# EAGLE schematic YMH01x (EAGLE 9.3.0)

## Sheet 1 of 2
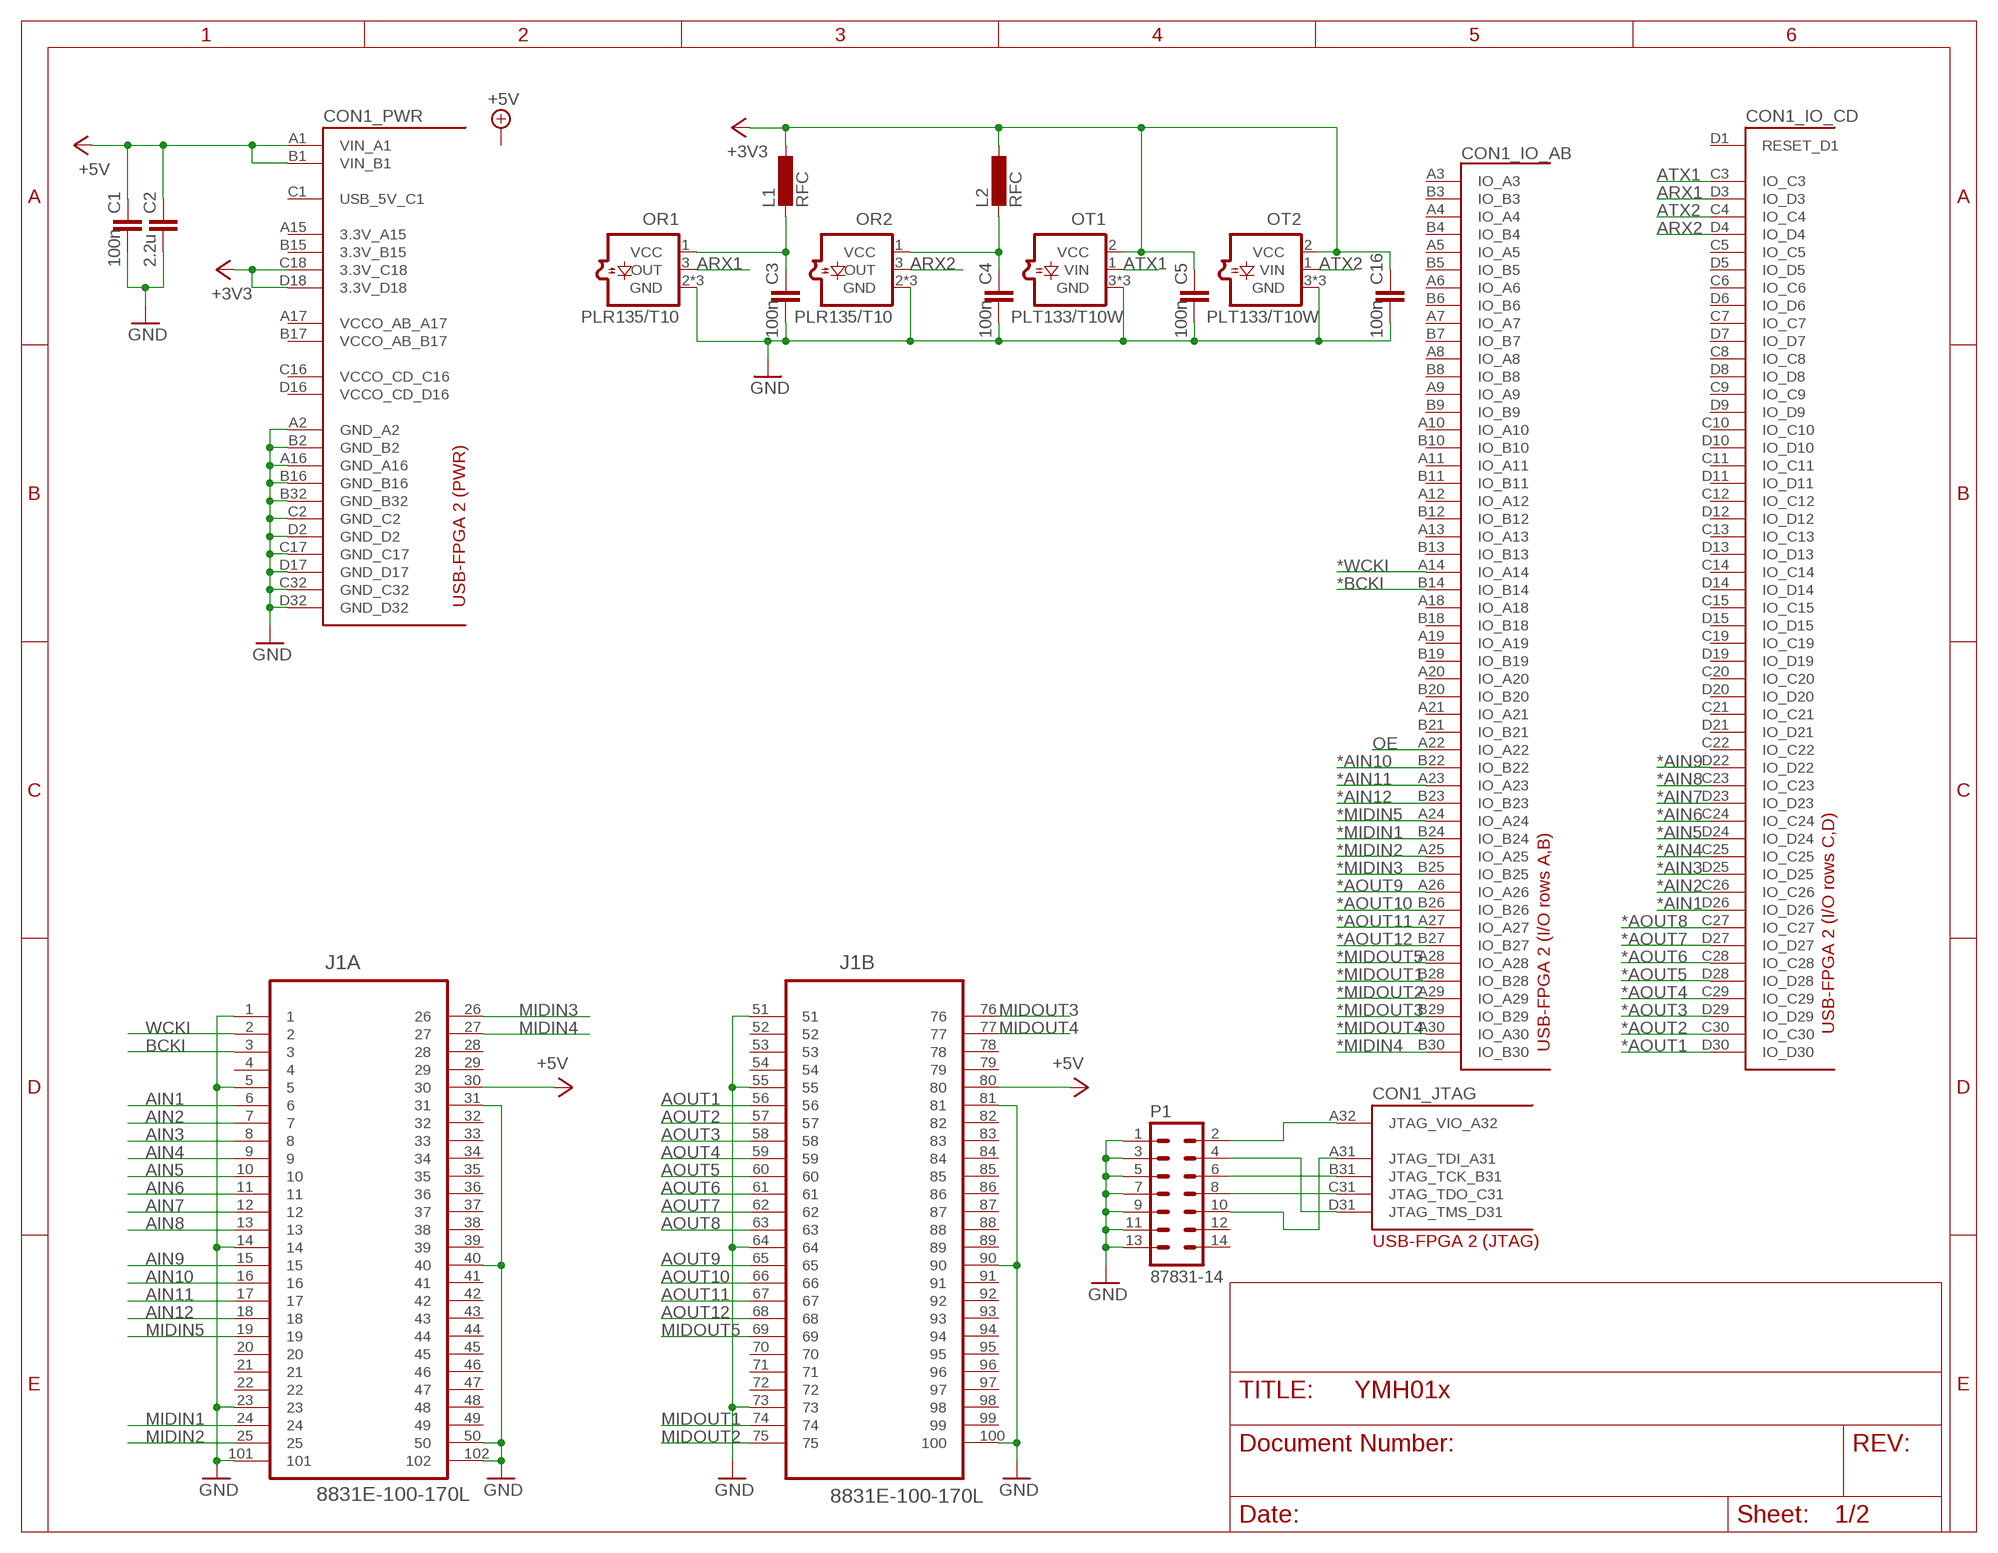
[diagram p0: schematic, sheet 1]

### Parts
C1  100n  C-EUC0603  [C0603]
C2  2.2u  C-EUC0603  [C0603]
C3  100n  C-EUC0603  [C0603]
C4  100n  C-EUC0603  [C0603]
C5  100n  C-EUC0603  [C0603]
C16  100n  C-EUC0603  [C0603]
CON1  USB-FPGA-2THT  [USB-FPGA-2-THT]
J1  8831E-100-170L  [KEL_8831E-100-170L]
L1  RFC  L-EUL2012C  [L2012C]
L2  RFC  L-EUL2012C  [L2012C]
OR1  PLR135/T10  [PLR135/T10]
OR2  PLR135/T10  [PLR135/T10]
OT1  PLT133/T10W  [PLT133/T10]
OT2  PLT133/T10W  [PLT133/T10]
P1  87831-14  [87831-14]

### Nets
*AIN1: CON1.D26(_IO_CD:IO_D26) ; also sheet 2
*AIN2: CON1.C26(_IO_CD:IO_C26) ; also sheet 2
*AIN3: CON1.D25(_IO_CD:IO_D25) ; also sheet 2
*AIN4: CON1.C25(_IO_CD:IO_C25) ; also sheet 2
*AIN5: CON1.D24(_IO_CD:IO_D24) ; also sheet 2
*AIN6: CON1.C24(_IO_CD:IO_C24) ; also sheet 2
*AIN7: CON1.D23(_IO_CD:IO_D23) ; also sheet 2
*AIN8: CON1.C23(_IO_CD:IO_C23) ; also sheet 2
*AIN9: CON1.D22(_IO_CD:IO_D22) ; also sheet 2
*AIN10: CON1.B22(_IO_AB:IO_B22) ; also sheet 2
*AIN11: CON1.A23(_IO_AB:IO_A23) ; also sheet 2
*AIN12: CON1.B23(_IO_AB:IO_B23) ; also sheet 2
*AOUT1: CON1.D30(_IO_CD:IO_D30) ; also sheet 2
*AOUT2: CON1.C30(_IO_CD:IO_C30) ; also sheet 2
*AOUT3: CON1.D29(_IO_CD:IO_D29) ; also sheet 2
*AOUT4: CON1.C29(_IO_CD:IO_C29) ; also sheet 2
*AOUT5: CON1.D28(_IO_CD:IO_D28) ; also sheet 2
*AOUT6: CON1.C28(_IO_CD:IO_C28) ; also sheet 2
*AOUT7: CON1.D27(_IO_CD:IO_D27) ; also sheet 2
*AOUT8: CON1.C27(_IO_CD:IO_C27) ; also sheet 2
*AOUT9: CON1.A26(_IO_AB:IO_A26) ; also sheet 2
*AOUT10: CON1.B26(_IO_AB:IO_B26) ; also sheet 2
*AOUT11: CON1.A27(_IO_AB:IO_A27) ; also sheet 2
*AOUT12: CON1.B27(_IO_AB:IO_B27) ; also sheet 2
*BCKI: CON1.B14(_IO_AB:IO_B14) ; also sheet 2
*MIDIN1: CON1.B24(_IO_AB:IO_B24) ; also sheet 2
*MIDIN2: CON1.A25(_IO_AB:IO_A25) ; also sheet 2
*MIDIN3: CON1.B25(_IO_AB:IO_B25) ; also sheet 2
*MIDIN4: CON1.B30(_IO_AB:IO_B30) ; also sheet 2
*MIDIN5: CON1.A24(_IO_AB:IO_A24) ; also sheet 2
*MIDOUT1: CON1.B28(_IO_AB:IO_B28) ; also sheet 2
*MIDOUT2: CON1.A29(_IO_AB:IO_A29) ; also sheet 2
*MIDOUT3: CON1.B29(_IO_AB:IO_B29) ; also sheet 2
*MIDOUT4: CON1.A30(_IO_AB:IO_A30) ; also sheet 2
*MIDOUT5: CON1.A28(_IO_AB:IO_A28) ; also sheet 2
*WCKI: CON1.A14(_IO_AB:IO_A14) ; also sheet 2
+3V3: C5.1 C16.1 CON1.C18(_PWR:3.3V_C18) CON1.D18(_PWR:3.3V_D18) L1.1 L2.1 OT1.2(VCC) OT2.2(VCC) ; also sheet 2
+5V: C1.1 C2.1 CON1.A1(_PWR:VIN_A1) CON1.B1(_PWR:VIN_B1) J1.30 J1.80 ; also sheet 2
AIN1: J1.6 ; also sheet 2
AIN2: J1.7 ; also sheet 2
AIN3: J1.8 ; also sheet 2
AIN4: J1.9 ; also sheet 2
AIN5: J1.10 ; also sheet 2
AIN6: J1.11 ; also sheet 2
AIN7: J1.12 ; also sheet 2
AIN8: J1.13 ; also sheet 2
AIN9: J1.15 ; also sheet 2
AIN10: J1.16 ; also sheet 2
AIN11: J1.17 ; also sheet 2
AIN12: J1.18 ; also sheet 2
AOUT1: J1.56 ; also sheet 2
AOUT2: J1.57 ; also sheet 2
AOUT3: J1.58 ; also sheet 2
AOUT4: J1.59 ; also sheet 2
AOUT5: J1.60 ; also sheet 2
AOUT6: J1.61 ; also sheet 2
AOUT7: J1.62 ; also sheet 2
AOUT8: J1.63 ; also sheet 2
AOUT9: J1.65 ; also sheet 2
AOUT10: J1.66 ; also sheet 2
AOUT11: J1.67 ; also sheet 2
AOUT12: J1.68 ; also sheet 2
ARX1: CON1.D3(_IO_CD:IO_D3) OR1.3(OUT)
ARX2: CON1.D4(_IO_CD:IO_D4) OR2.3(OUT)
ATX1: CON1.C3(_IO_CD:IO_C3) OT1.1(VIN)
ATX2: CON1.C4(_IO_CD:IO_C4) OT2.1(VIN)
BCKI: J1.3 ; also sheet 2
GND: C1.2 C2.2 C3.2 C4.2 C5.2 C16.2 CON1.A2(_PWR:GND_A2) CON1.A16(_PWR:GND_A16) CON1.B2(_PWR:GND_B2) CON1.B16(_PWR:GND_B16) CON1.B32(_PWR:GND_B32) CON1.C2(_PWR:GND_C2) CON1.C17(_PWR:GND_C17) CON1.C32(_PWR:GND_C32) CON1.D2(_PWR:GND_D2) CON1.D17(_PWR:GND_D17) CON1.D32(_PWR:GND_D32) J1.1 J1.5 J1.14 J1.23 J1.31 J1.40 J1.50 J1.51 J1.55 J1.64 J1.73 J1.81 J1.90 J1.100 J1.101 J1.102 OR1.2(GND) OR1.NC1(GND) OR1.NC2(GND) OR2.2(GND) OR2.NC1(GND) OR2.NC2(GND) OT1.3(GND) OT1.NC1(GND) OT1.NC2(GND) OT2.3(GND) OT2.NC1(GND) OT2.NC2(GND) P1.1 P1.3 P1.5 P1.7 P1.9 P1.11 P1.13 ; also sheet 2
MIDIN1: J1.24 ; also sheet 2
MIDIN2: J1.25 ; also sheet 2
MIDIN3: J1.26 ; also sheet 2
MIDIN4: J1.27 ; also sheet 2
MIDIN5: J1.19 ; also sheet 2
MIDOUT1: J1.74 ; also sheet 2
MIDOUT2: J1.75 ; also sheet 2
MIDOUT3: J1.76 ; also sheet 2
MIDOUT4: J1.77 ; also sheet 2
MIDOUT5: J1.69 ; also sheet 2
N$1: CON1.A32(_JTAG:JTAG_VIO_A32) P1.2
N$2: CON1.D31(_JTAG:JTAG_TMS_D31) P1.4
N$3: CON1.B31(_JTAG:JTAG_TCK_B31) P1.6
N$4: CON1.C31(_JTAG:JTAG_TDO_C31) P1.8
N$5: CON1.A31(_JTAG:JTAG_TDI_A31) P1.10
N$7: C3.1 L1.2 OR1.1(VCC)
N$8: C4.1 L2.2 OR2.1(VCC)
OE: CON1.A22(_IO_AB:IO_A22) ; also sheet 2
WCKI: J1.2 ; also sheet 2
Unconnected: CON1.A3(_IO_AB:IO_A3) CON1.A4(_IO_AB:IO_A4) CON1.A5(_IO_AB:IO_A5) CON1.A6(_IO_AB:IO_A6) CON1.A7(_IO_AB:IO_A7) CON1.A8(_IO_AB:IO_A8) CON1.A9(_IO_AB:IO_A9) CON1.A10(_IO_AB:IO_A10) CON1.A11(_IO_AB:IO_A11) CON1.A12(_IO_AB:IO_A12) CON1.A13(_IO_AB:IO_A13) CON1.A15(_PWR:3.3V_A15) CON1.A17(_PWR:VCCO_AB_A17) CON1.A18(_IO_AB:IO_A18) CON1.A19(_IO_AB:IO_A19) CON1.A20(_IO_AB:IO_A20) CON1.A21(_IO_AB:IO_A21) CON1.B3(_IO_AB:IO_B3) CON1.B4(_IO_AB:IO_B4) CON1.B5(_IO_AB:IO_B5) CON1.B6(_IO_AB:IO_B6) CON1.B7(_IO_AB:IO_B7) CON1.B8(_IO_AB:IO_B8) CON1.B9(_IO_AB:IO_B9) CON1.B10(_IO_AB:IO_B10) CON1.B11(_IO_AB:IO_B11) CON1.B12(_IO_AB:IO_B12) CON1.B13(_IO_AB:IO_B13) CON1.B15(_PWR:3.3V_B15) CON1.B17(_PWR:VCCO_AB_B17) CON1.B18(_IO_AB:IO_B18) CON1.B19(_IO_AB:IO_B19) CON1.B20(_IO_AB:IO_B20) CON1.B21(_IO_AB:IO_B21) CON1.C1(_PWR:USB_5V_C1) CON1.C5(_IO_CD:IO_C5) CON1.C6(_IO_CD:IO_C6) CON1.C7(_IO_CD:IO_C7) CON1.C8(_IO_CD:IO_C8) CON1.C9(_IO_CD:IO_C9) CON1.C10(_IO_CD:IO_C10) CON1.C11(_IO_CD:IO_C11) CON1.C12(_IO_CD:IO_C12) CON1.C13(_IO_CD:IO_C13) CON1.C14(_IO_CD:IO_C14) CON1.C15(_IO_CD:IO_C15) CON1.C16(_PWR:VCCO_CD_C16) CON1.C19(_IO_CD:IO_C19) CON1.C20(_IO_CD:IO_C20) CON1.C21(_IO_CD:IO_C21) CON1.C22(_IO_CD:IO_C22) CON1.D1(_IO_CD:RESET_D1) CON1.D5(_IO_CD:IO_D5) CON1.D6(_IO_CD:IO_D6) CON1.D7(_IO_CD:IO_D7) CON1.D8(_IO_CD:IO_D8) CON1.D9(_IO_CD:IO_D9) CON1.D10(_IO_CD:IO_D10) CON1.D11(_IO_CD:IO_D11) CON1.D12(_IO_CD:IO_D12) CON1.D13(_IO_CD:IO_D13) CON1.D14(_IO_CD:IO_D14) CON1.D15(_IO_CD:IO_D15) CON1.D16(_PWR:VCCO_CD_D16) CON1.D19(_IO_CD:IO_D19) CON1.D20(_IO_CD:IO_D20) CON1.D21(_IO_CD:IO_D21) J1.4 J1.20 J1.21 J1.22 J1.28 J1.29 J1.32 J1.33 J1.34 J1.35 J1.36 J1.37 J1.38 J1.39 J1.41 J1.42 J1.43 J1.44 J1.45 J1.46 J1.47 J1.48 J1.49 J1.52 J1.53 J1.54 J1.70 J1.71 J1.72 J1.78 J1.79 J1.82 J1.83 J1.84 J1.85 J1.86 J1.87 J1.88 J1.89 J1.91 J1.92 J1.93 J1.94 J1.95 J1.96 J1.97 J1.98 J1.99 P1.12 P1.14

## Sheet 2 of 2
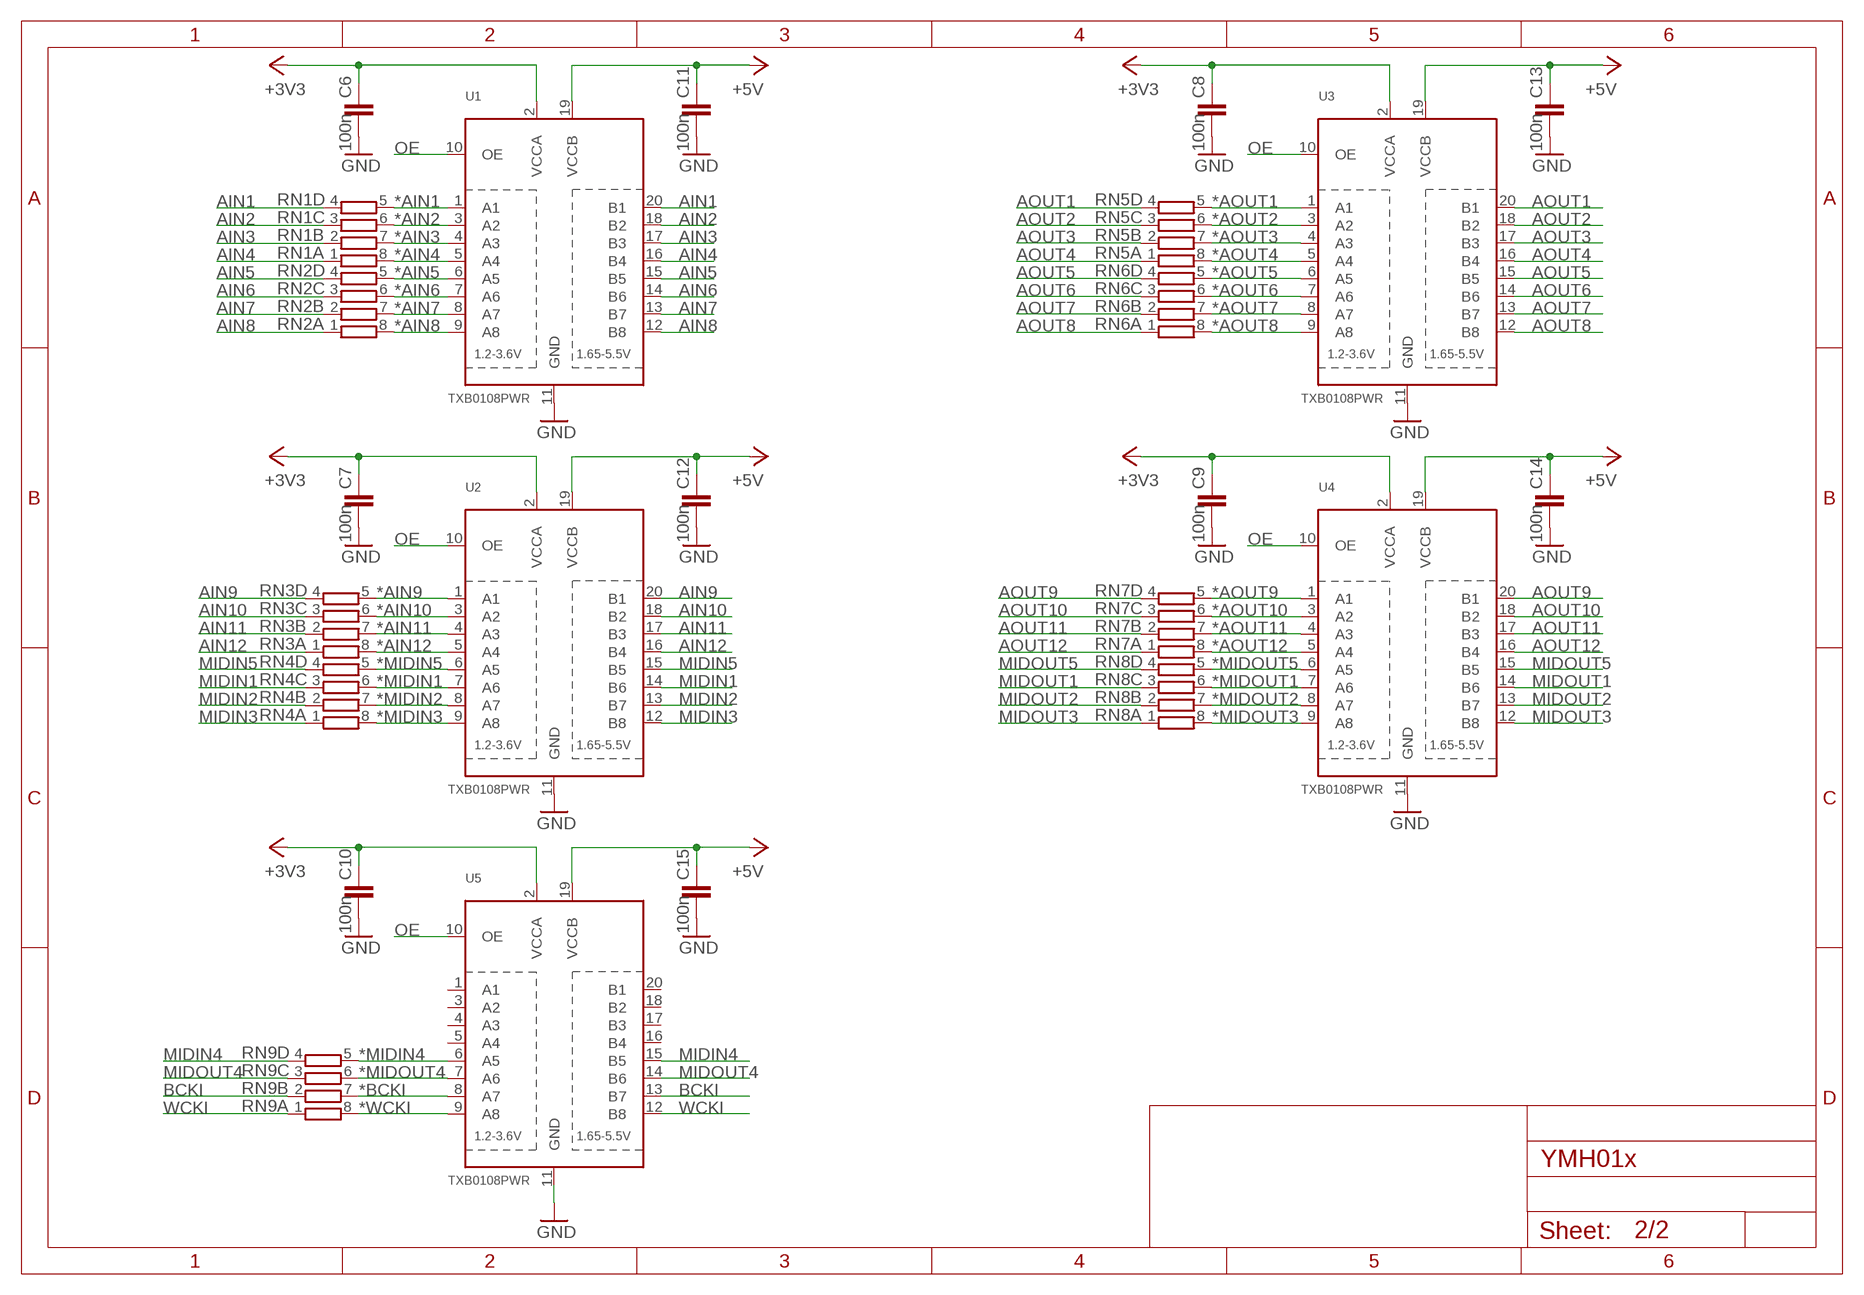
[diagram p1: schematic, sheet 2]

### Parts
C6  100n  C-EUC0603  [C0603]
C7  100n  C-EUC0603  [C0603]
C8  100n  C-EUC0603  [C0603]
C9  100n  C-EUC0603  [C0603]
C10  100n  C-EUC0603  [C0603]
C11  100n  C-EUC0603  [C0603]
C12  100n  C-EUC0603  [C0603]
C13  100n  C-EUC0603  [C0603]
C14  100n  C-EUC0603  [C0603]
C15  100n  C-EUC0603  [C0603]
RN1  4R-N0603-ARC  [0603-ARC]
RN2  4R-N0603-ARC  [0603-ARC]
RN3  4R-N0603-ARC  [0603-ARC]
RN4  4R-N0603-ARC  [0603-ARC]
RN5  4R-N0603-ARC  [0603-ARC]
RN6  4R-N0603-ARC  [0603-ARC]
RN7  4R-N0603-ARC  [0603-ARC]
RN8  4R-N0603-ARC  [0603-ARC]
RN9  4R-N0603-ARC  [0603-ARC]
U1  TXB0108PWR  [TSSOP20]
U2  TXB0108PWR  [TSSOP20]
U3  TXB0108PWR  [TSSOP20]
U4  TXB0108PWR  [TSSOP20]
U5  TXB0108PWR  [TSSOP20]

### Nets
*AIN1: RN1.5 U1.1(A1) ; also sheet 1
*AIN2: RN1.6 U1.3(A2) ; also sheet 1
*AIN3: RN1.7 U1.4(A3) ; also sheet 1
*AIN4: RN1.8 U1.5(A4) ; also sheet 1
*AIN5: RN2.5 U1.6(A5) ; also sheet 1
*AIN6: RN2.6 U1.7(A6) ; also sheet 1
*AIN7: RN2.7 U1.8(A7) ; also sheet 1
*AIN8: RN2.8 U1.9(A8) ; also sheet 1
*AIN9: RN3.5 U2.1(A1) ; also sheet 1
*AIN10: RN3.6 U2.3(A2) ; also sheet 1
*AIN11: RN3.7 U2.4(A3) ; also sheet 1
*AIN12: RN3.8 U2.5(A4) ; also sheet 1
*AOUT1: RN5.5 U3.1(A1) ; also sheet 1
*AOUT2: RN5.6 U3.3(A2) ; also sheet 1
*AOUT3: RN5.7 U3.4(A3) ; also sheet 1
*AOUT4: RN5.8 U3.5(A4) ; also sheet 1
*AOUT5: RN6.5 U3.6(A5) ; also sheet 1
*AOUT6: RN6.6 U3.7(A6) ; also sheet 1
*AOUT7: RN6.7 U3.8(A7) ; also sheet 1
*AOUT8: RN6.8 U3.9(A8) ; also sheet 1
*AOUT9: RN7.5 U4.1(A1) ; also sheet 1
*AOUT10: RN7.6 U4.3(A2) ; also sheet 1
*AOUT11: RN7.7 U4.4(A3) ; also sheet 1
*AOUT12: RN7.8 U4.5(A4) ; also sheet 1
*BCKI: RN9.7 U5.8(A7) ; also sheet 1
*MIDIN1: RN4.6 U2.7(A6) ; also sheet 1
*MIDIN2: RN4.7 U2.8(A7) ; also sheet 1
*MIDIN3: RN4.8 U2.9(A8) ; also sheet 1
*MIDIN4: RN9.5 U5.6(A5) ; also sheet 1
*MIDIN5: RN4.5 U2.6(A5) ; also sheet 1
*MIDOUT1: RN8.6 U4.7(A6) ; also sheet 1
*MIDOUT2: RN8.7 U4.8(A7) ; also sheet 1
*MIDOUT3: RN8.8 U4.9(A8) ; also sheet 1
*MIDOUT4: RN9.6 U5.7(A6) ; also sheet 1
*MIDOUT5: RN8.5 U4.6(A5) ; also sheet 1
*WCKI: RN9.8 U5.9(A8) ; also sheet 1
+3V3: C6.1 C7.1 C8.1 C9.1 C10.1 U1.2(VCCA) U2.2(VCCA) U3.2(VCCA) U4.2(VCCA) U5.2(VCCA) ; also sheet 1
+5V: C11.1 C12.1 C13.1 C14.1 C15.1 U1.19(VCCB) U2.19(VCCB) U3.19(VCCB) U4.19(VCCB) U5.19(VCCB) ; also sheet 1
AIN1: RN1.4 U1.20(B1) ; also sheet 1
AIN2: RN1.3 U1.18(B2) ; also sheet 1
AIN3: RN1.2 U1.17(B3) ; also sheet 1
AIN4: RN1.1 U1.16(B4) ; also sheet 1
AIN5: RN2.4 U1.15(B5) ; also sheet 1
AIN6: RN2.3 U1.14(B6) ; also sheet 1
AIN7: RN2.2 U1.13(B7) ; also sheet 1
AIN8: RN2.1 U1.12(B8) ; also sheet 1
AIN9: RN3.4 U2.20(B1) ; also sheet 1
AIN10: RN3.3 U2.18(B2) ; also sheet 1
AIN11: RN3.2 U2.17(B3) ; also sheet 1
AIN12: RN3.1 U2.16(B4) ; also sheet 1
AOUT1: RN5.4 U3.20(B1) ; also sheet 1
AOUT2: RN5.3 U3.18(B2) ; also sheet 1
AOUT3: RN5.2 U3.17(B3) ; also sheet 1
AOUT4: RN5.1 U3.16(B4) ; also sheet 1
AOUT5: RN6.4 U3.15(B5) ; also sheet 1
AOUT6: RN6.3 U3.14(B6) ; also sheet 1
AOUT7: RN6.2 U3.13(B7) ; also sheet 1
AOUT8: RN6.1 U3.12(B8) ; also sheet 1
AOUT9: RN7.4 U4.20(B1) ; also sheet 1
AOUT10: RN7.3 U4.18(B2) ; also sheet 1
AOUT11: RN7.2 U4.17(B3) ; also sheet 1
AOUT12: RN7.1 U4.16(B4) ; also sheet 1
BCKI: RN9.2 U5.13(B7) ; also sheet 1
GND: C6.2 C7.2 C8.2 C9.2 C10.2 C11.2 C12.2 C13.2 C14.2 C15.2 U1.11(GND) U2.11(GND) U3.11(GND) U4.11(GND) U5.11(GND) ; also sheet 1
MIDIN1: RN4.3 U2.14(B6) ; also sheet 1
MIDIN2: RN4.2 U2.13(B7) ; also sheet 1
MIDIN3: RN4.1 U2.12(B8) ; also sheet 1
MIDIN4: RN9.4 U5.15(B5) ; also sheet 1
MIDIN5: RN4.4 U2.15(B5) ; also sheet 1
MIDOUT1: RN8.3 U4.14(B6) ; also sheet 1
MIDOUT2: RN8.2 U4.13(B7) ; also sheet 1
MIDOUT3: RN8.1 U4.12(B8) ; also sheet 1
MIDOUT4: RN9.3 U5.14(B6) ; also sheet 1
MIDOUT5: RN8.4 U4.15(B5) ; also sheet 1
OE: U1.10(OE) U2.10(OE) U3.10(OE) U4.10(OE) U5.10(OE) ; also sheet 1
WCKI: RN9.1 U5.12(B8) ; also sheet 1
Unconnected: U5.1(A1) U5.3(A2) U5.4(A3) U5.5(A4) U5.16(B4) U5.17(B3) U5.18(B2) U5.20(B1)

## Library data of the parts
C1-C16 = rcl:C-EU: CAPACITOR, European symbol; SPICEPREFIX: C
CON1 = ztex-fpga-2:USB-FPGA-2
J1 = KEL:8831E-100-170L: CONN RCPT 1.27MM 100POS GOLD PCB; DESCRIPTION: CONN-100POS; MPN: KEL_8831E-100-170L; ROHS: Yes; SUPPLIER: KEL
L1 L2 = rcl:L-EU: INDUCTOR, European symbol; SPICEPREFIX: L
OR1 OR2 = everlight:PLR135/T10
OT1 OT2 = everlight:PLT133/T10W
P1 = con-molex-milli-grid:87831-14: HEADER
RN1-RN9 = resistor-dil:4R-N: Array Chip Resistor Source: RS Component / Phycomp; OC_FARNELL: unknown; OC_NEWARK: unknown
U1-U5 = adafruit:TXB0108PWR: 8-Bit Bi-Directional Level Shifter 1.2V-3.6V (VCCA) to 1.65V-5.5V (VCCB) bi-directional level shifter with auto direction sensing. Max data rate - VCCA 1.8V: 20Mbps (50ns), VCCA 3.3V: 100Mbps (10ns) Digikey: 296-21527-1-ND

## Net classes
1 +5V: width 0.635 mm